# Altium schematic sheet P6_CCD_CAM_BOARD_HDMI.SchDoc
size A4
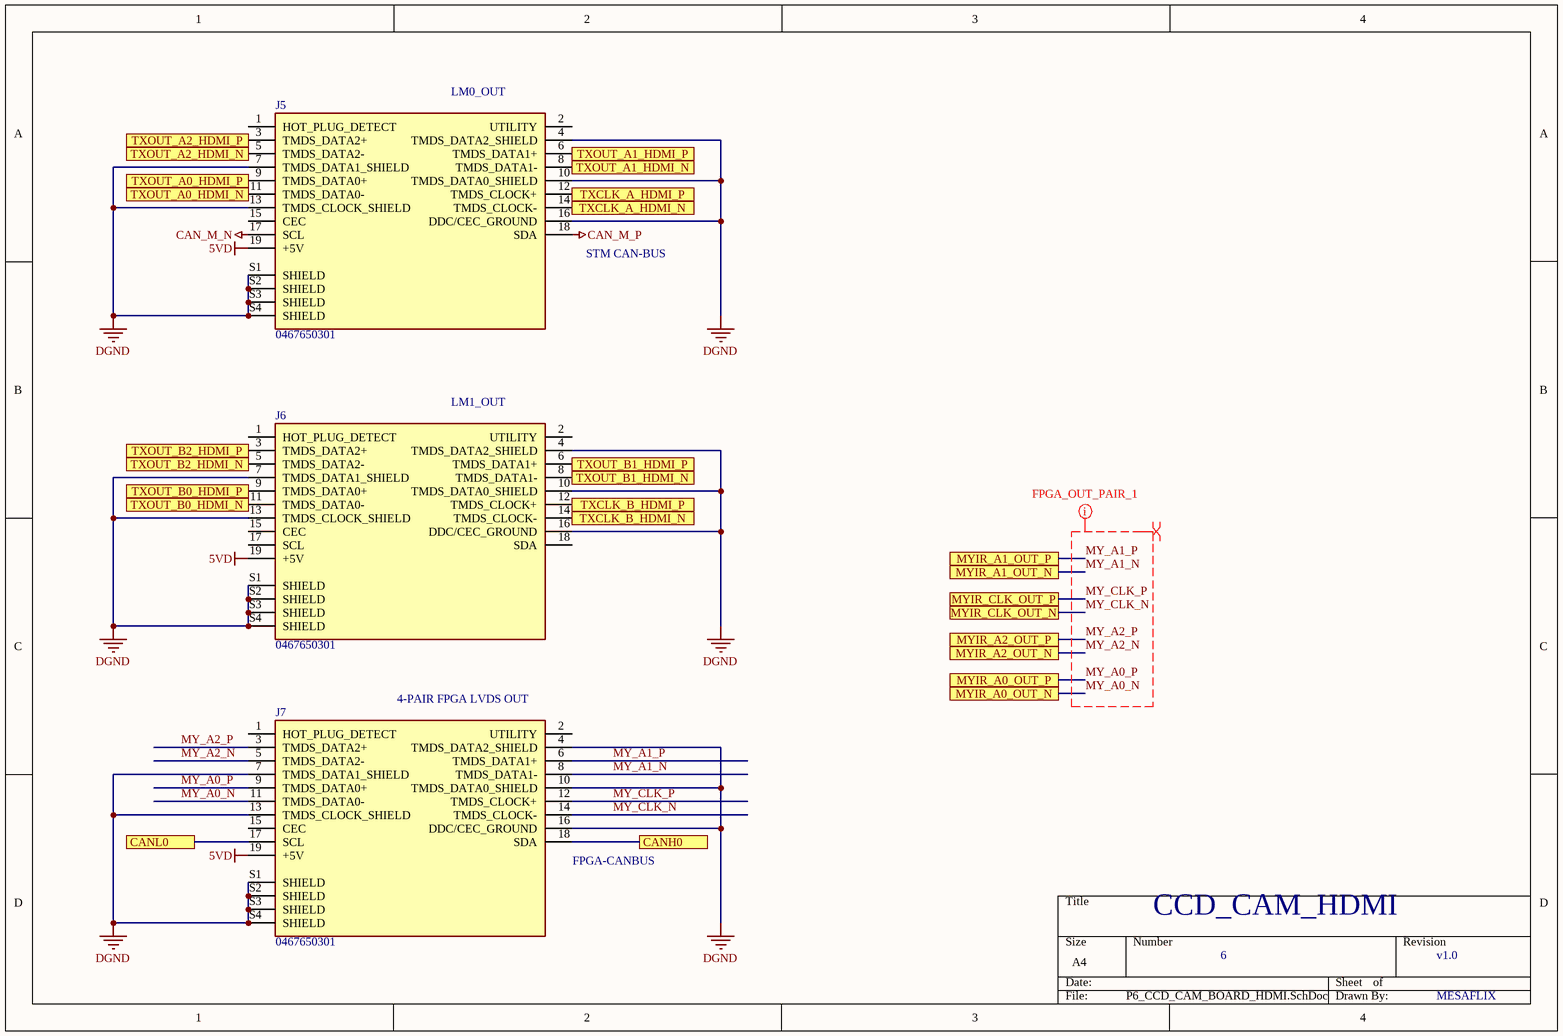
[diagram p0: P6_CCD_CAM_BOARD_HDMI.SchDoc]

## Parts
J5  0467650301  [MOLEX_0467650301]
J6  0467650301  [MOLEX_0467650301]
J7  0467650301  [MOLEX_0467650301]

## Ports
CANH0, CANL0, MYIR_A0_OUT_N, MYIR_A0_OUT_P, MYIR_A1_OUT_N, MYIR_A1_OUT_P, MYIR_A2_OUT_N, MYIR_A2_OUT_P, MYIR_CLK_OUT_N, MYIR_CLK_OUT_P, TXCLK_A_HDMI_N, TXCLK_A_HDMI_P, TXCLK_B_HDMI_N, TXCLK_B_HDMI_P, TXOUT_A0_HDMI_N, TXOUT_A0_HDMI_P, TXOUT_A1_HDMI_N, TXOUT_A1_HDMI_P, TXOUT_A2_HDMI_N, TXOUT_A2_HDMI_P, TXOUT_B0_HDMI_N, TXOUT_B0_HDMI_P, TXOUT_B1_HDMI_N, TXOUT_B1_HDMI_P, TXOUT_B2_HDMI_N, TXOUT_B2_HDMI_P

## Nets
5VD: J5.19(+5V) J6.19(+5V) J7.19(+5V)
CAN_M_N: J5.17(SCL)
CAN_M_P: J5.18(SDA)
DGND: J5.4(TMDS_DATA2_SHIELD) J5.7(TMDS_DATA1_SHIELD) J5.10(TMDS_DATA0_SHIELD) J5.13(TMDS_CLOCK_SHIELD) J5.16(DDC/CEC_GROUND) J5.S1(SHIELD) J5.S2(SHIELD) J5.S3(SHIELD) J5.S4(SHIELD) J6.4(TMDS_DATA2_SHIELD) J6.7(TMDS_DATA1_SHIELD) J6.10(TMDS_DATA0_SHIELD) J6.13(TMDS_CLOCK_SHIELD) J6.16(DDC/CEC_GROUND) J6.S1(SHIELD) J6.S2(SHIELD) J6.S3(SHIELD) J6.S4(SHIELD) J7.4(TMDS_DATA2_SHIELD) J7.7(TMDS_DATA1_SHIELD) J7.10(TMDS_DATA0_SHIELD) J7.13(TMDS_CLOCK_SHIELD) J7.16(DDC/CEC_GROUND) J7.S1(SHIELD) J7.S2(SHIELD) J7.S3(SHIELD) J7.S4(SHIELD)
CANH0: J7.18(SDA) ; port CANH0
CANL0: J7.17(SCL) ; port CANL0
MY_A0_N: J7.11(TMDS_DATA0-) ; port MYIR_A0_OUT_N
MY_A0_P: J7.9(TMDS_DATA0+) ; port MYIR_A0_OUT_P
MY_A1_N: J7.8(TMDS_DATA1-) ; port MYIR_A1_OUT_N
MY_A1_P: J7.6(TMDS_DATA1+) ; port MYIR_A1_OUT_P
MY_A2_N: J7.5(TMDS_DATA2-) ; port MYIR_A2_OUT_N
MY_A2_P: J7.3(TMDS_DATA2+) ; port MYIR_A2_OUT_P
MY_CLK_N: J7.14(TMDS_CLOCK-) ; port MYIR_CLK_OUT_N
MY_CLK_P: J7.12(TMDS_CLOCK+) ; port MYIR_CLK_OUT_P
TXCLK_A_HDMI_N: J5.14(TMDS_CLOCK-) ; port TXCLK_A_HDMI_N
TXCLK_A_HDMI_P: J5.12(TMDS_CLOCK+) ; port TXCLK_A_HDMI_P
TXCLK_B_HDMI_N: J6.14(TMDS_CLOCK-) ; port TXCLK_B_HDMI_N
TXCLK_B_HDMI_P: J6.12(TMDS_CLOCK+) ; port TXCLK_B_HDMI_P
TXOUT_A0_HDMI_N: J5.11(TMDS_DATA0-) ; port TXOUT_A0_HDMI_N
TXOUT_A0_HDMI_P: J5.9(TMDS_DATA0+) ; port TXOUT_A0_HDMI_P
TXOUT_A1_HDMI_N: J5.8(TMDS_DATA1-) ; port TXOUT_A1_HDMI_N
TXOUT_A1_HDMI_P: J5.6(TMDS_DATA1+) ; port TXOUT_A1_HDMI_P
TXOUT_A2_HDMI_N: J5.5(TMDS_DATA2-) ; port TXOUT_A2_HDMI_N
TXOUT_A2_HDMI_P: J5.3(TMDS_DATA2+) ; port TXOUT_A2_HDMI_P
TXOUT_B0_HDMI_N: J6.11(TMDS_DATA0-) ; port TXOUT_B0_HDMI_N
TXOUT_B0_HDMI_P: J6.9(TMDS_DATA0+) ; port TXOUT_B0_HDMI_P
TXOUT_B1_HDMI_N: J6.8(TMDS_DATA1-) ; port TXOUT_B1_HDMI_N
TXOUT_B1_HDMI_P: J6.6(TMDS_DATA1+) ; port TXOUT_B1_HDMI_P
TXOUT_B2_HDMI_N: J6.5(TMDS_DATA2-) ; port TXOUT_B2_HDMI_N
TXOUT_B2_HDMI_P: J6.3(TMDS_DATA2+) ; port TXOUT_B2_HDMI_P

Not connected (* = marked no-connect by the designer): J5 1(HOT_PLUG_DETECT) 2(UTILITY) 15(CEC); J6 1(HOT_PLUG_DETECT) 2(UTILITY) 15(CEC) 17(SCL) 18(SDA); J7 1(HOT_PLUG_DETECT) 2(UTILITY) 15(CEC)

## Layout directives
differential pair: MY_A0_N, MY_A0_P, MY_A1_N, MY_A1_P, MY_A2_N, MY_A2_P, MY_CLK_N, MY_CLK_P
mark named FPGA_OUT_PAIR_1: MY_A0_N, MY_A0_P, MY_A1_N, MY_A1_P, MY_A2_N, MY_A2_P, MY_CLK_N, MY_CLK_P

## Notes on the sheet
- (near J5) LM0_OUT
- (near J5) STM CAN-BUS
- (near J6) LM1_OUT
- (near J7) 4-PAIR FPGA LVDS OUT
- (near J7) FPGA-CANBUS
- CCD_CAM_HDMI
- 6
- v1.0
- MESAFLIX

## Library data of the parts
J5-J7 = 0467650301: HDMI - Micro Receptacle Connector 19 Position Surface Mount, Right Angle; MF: Molex; Value: *; Package: None; Price: None; MP: 0467650301; SnapEDA_Link: https://www.snapeda.com/parts/0467650301/Molex/view-part/2155824/?ref=snap; Availability: Unavailable